# EAGLE design board-v4 (EAGLE 6.5.0)
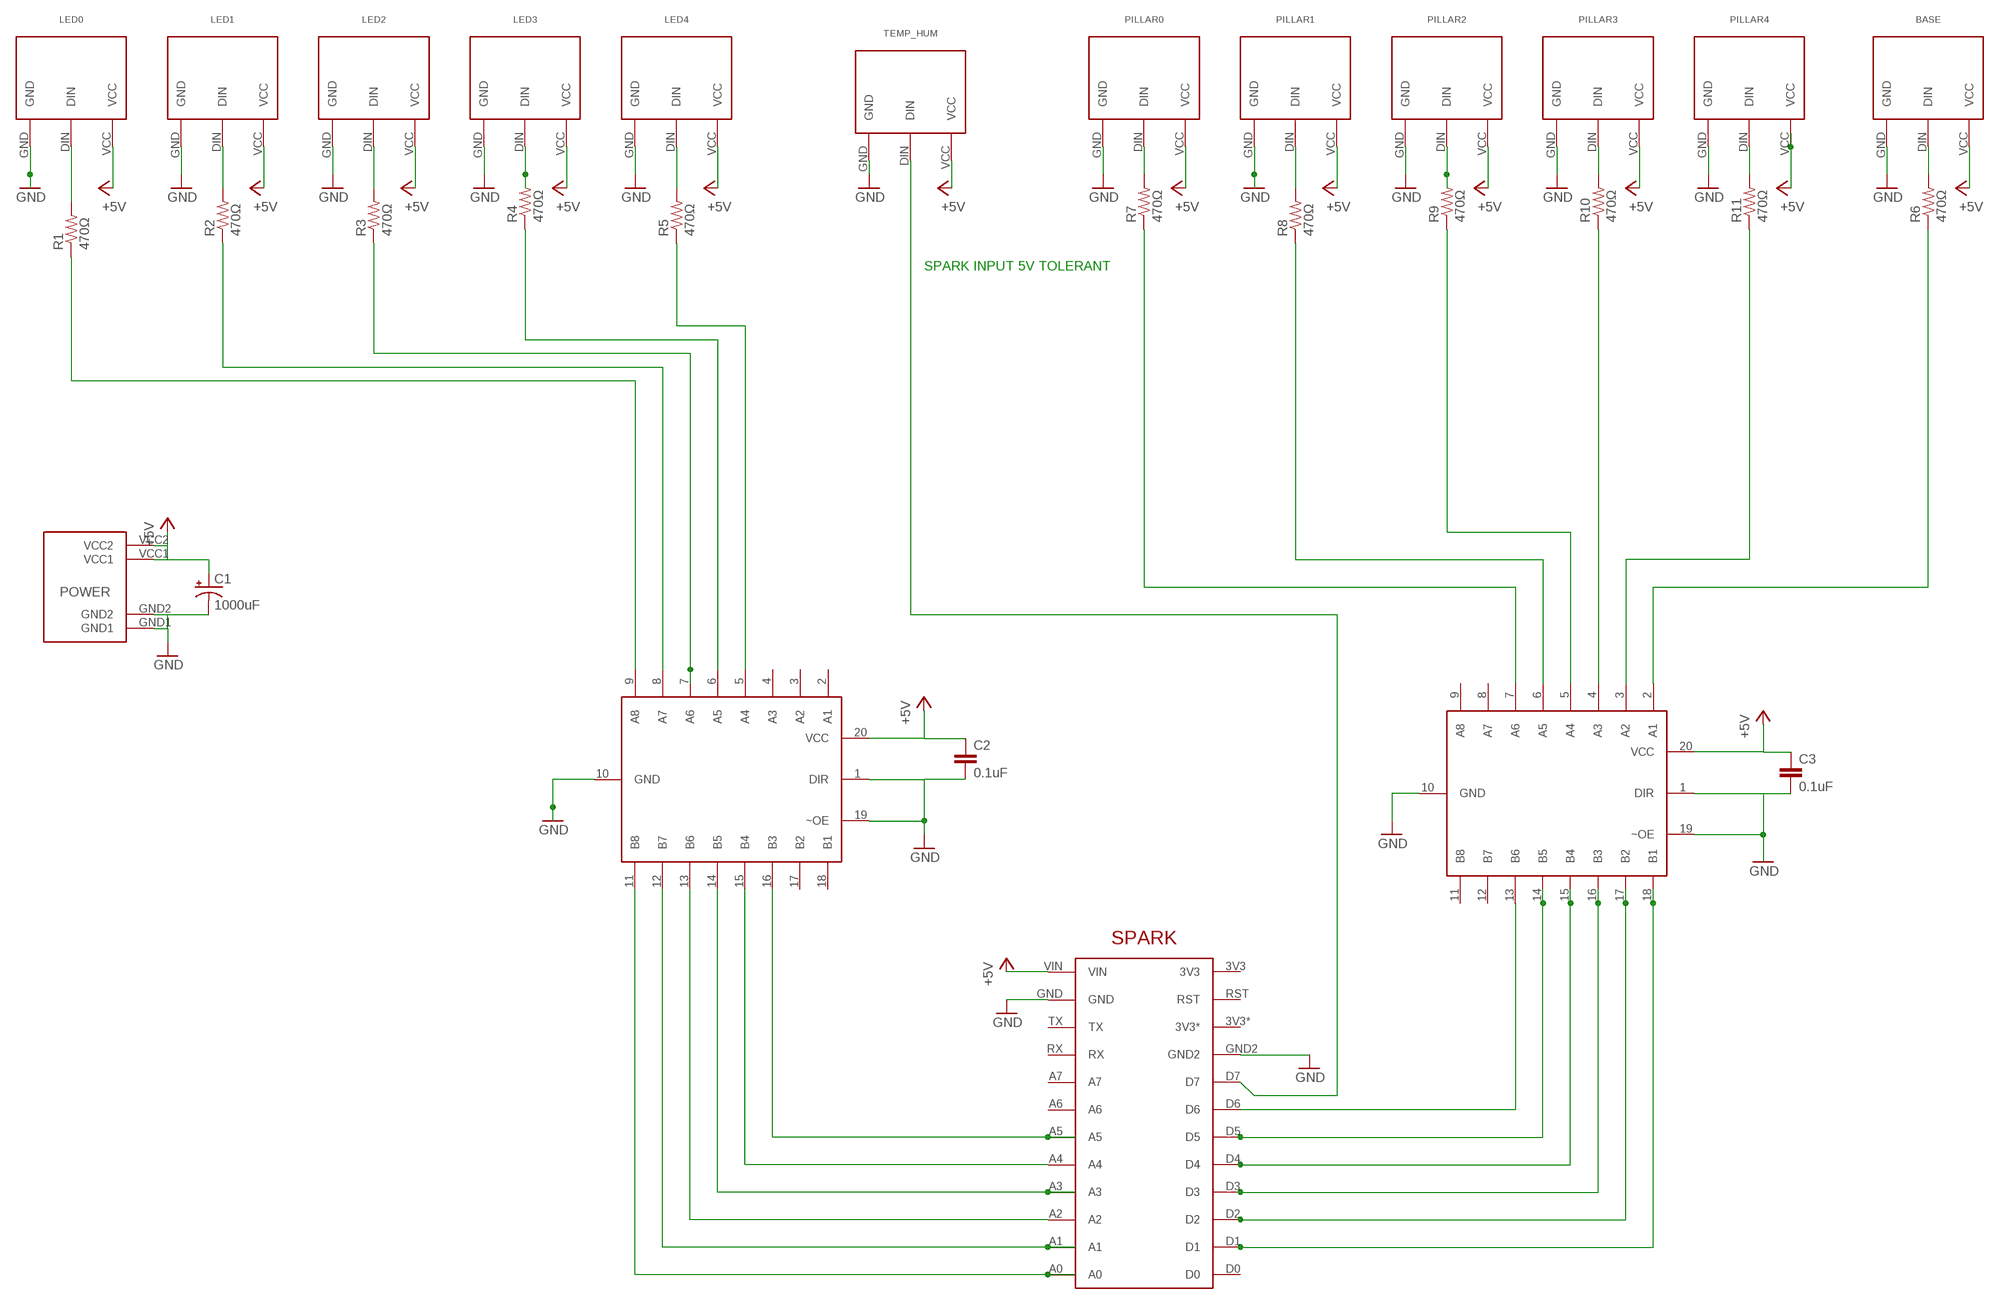
[diagram p0: schematic, sheet 1]

## Parts
BASE  MOLEX_3PIN_SMT_43650-310  [MOLEX_3PIN_SMT_43650-310]
C1  1000uF  CAP_POLPTH4  [CPOL-RADIAL-1000UF-25V]
C2  0.1uF  CAP0805  [0805]
C3  0.1uF  CAP0805  [0805]
LED0  MOLEX_3PIN_SMT_43650-310  [MOLEX_3PIN_SMT_43650-310]
LED1  MOLEX_3PIN_SMT_43650-310  [MOLEX_3PIN_SMT_43650-310]
LED2  MOLEX_3PIN_SMT_43650-310  [MOLEX_3PIN_SMT_43650-310]
LED3  MOLEX_3PIN_SMT_43650-310  [MOLEX_3PIN_SMT_43650-310]
LED4  MOLEX_3PIN_SMT_43650-310  [MOLEX_3PIN_SMT_43650-310]
PILLAR0  MOLEX_3PIN_SMT_43650-310  [MOLEX_3PIN_SMT_43650-310]
PILLAR1  MOLEX_3PIN_SMT_43650-310  [MOLEX_3PIN_SMT_43650-310]
PILLAR2  MOLEX_3PIN_SMT_43650-310  [MOLEX_3PIN_SMT_43650-310]
PILLAR3  MOLEX_3PIN_SMT_43650-310  [MOLEX_3PIN_SMT_43650-310]
PILLAR4  MOLEX_3PIN_SMT_43650-310  [MOLEX_3PIN_SMT_43650-310]
POWER  MOLEX_2PIN_SABRE_POWER  [MOLEX_2PIN_SABRE_POWER]
R1  470Ω  RESISTOR0805-RES  [0805]
R2  470Ω  RESISTOR0805-RES  [0805]
R3  470Ω  RESISTOR0805-RES  [0805]
R4  470Ω  RESISTOR0805-RES  [0805]
R5  470Ω  RESISTOR0805-RES  [0805]
R6  470Ω  RESISTOR0805-RES  [0805]
R7  470Ω  RESISTOR0805-RES  [0805]
R8  470Ω  RESISTOR0805-RES  [0805]
R9  470Ω  RESISTOR0805-RES  [0805]
R10  470Ω  RESISTOR0805-RES  [0805]
R11  470Ω  RESISTOR0805-RES  [0805]
SHIFT1  TI_74HCT245DWR  [SOIC-20]
SHIFT2  TI_74HCT245DWR  [SOIC-20]
SPARK  SPARKCORE  [SPARKCORE]
TEMP_HUM  MOLEX_3PIN_SMT_43650-310  [MOLEX_3PIN_SMT_43650-310]

## Nets
+5V [power]: BASE.VCC C1.1(+) C2.1 C3.1 LED0.VCC LED1.VCC LED2.VCC LED3.VCC LED4.VCC PILLAR0.VCC PILLAR1.VCC PILLAR2.VCC PILLAR3.VCC PILLAR4.VCC POWER.VCC1 POWER.VCC2 SHIFT1.20(VCC) SHIFT2.20(VCC) SPARK.VIN TEMP_HUM.VCC
GND [power]: BASE.GND C1.2(-) C2.2 C3.2 LED0.GND LED1.GND LED2.GND LED3.GND LED4.GND PILLAR0.GND PILLAR1.GND PILLAR2.GND PILLAR3.GND PILLAR4.GND POWER.GND1 POWER.GND2 SHIFT1.1(DIR) SHIFT1.10(GND) SHIFT1.19(~OE) SHIFT2.1(DIR) SHIFT2.10(GND) SHIFT2.19(~OE) SPARK.GND SPARK.GND2 TEMP_HUM.GND
N$1: SPARK.D7 TEMP_HUM.DIN
N$2: SHIFT2.17(B2) SPARK.D2
N$3: PILLAR0.DIN R7.2
N$4: LED0.DIN R1.2
N$5: R1.1 SHIFT1.9(A8)
N$6: LED1.DIN R2.2
N$7: LED2.DIN R3.2
N$8: LED3.DIN R4.2
N$9: LED4.DIN R5.2
N$10: R6.1 SHIFT2.2(A1)
N$11: BASE.DIN R6.2
N$13: R11.1 SHIFT2.3(A2)
N$14: PILLAR1.DIN R8.2
N$15: R10.1 SHIFT2.4(A3)
N$16: PILLAR2.DIN R9.2
N$17: PILLAR3.DIN R10.2
N$18: PILLAR4.DIN R11.2
N$19: R2.1 SHIFT1.8(A7)
N$20: R3.1 SHIFT1.7(A6)
N$21: R4.1 SHIFT1.6(A5)
N$22: R5.1 SHIFT1.5(A4)
N$23: R9.1 SHIFT2.5(A4)
N$24: R8.1 SHIFT2.6(A5)
N$25: R7.1 SHIFT2.7(A6)
N$26: SHIFT2.13(B6) SPARK.D6
N$30: SHIFT2.18(B1) SPARK.D1
N$31: SHIFT2.16(B3) SPARK.D3
N$32: SHIFT2.14(B5) SPARK.D5
N$33: SHIFT2.15(B4) SPARK.D4
N$34: SHIFT1.11(B8) SPARK.A0
N$35: SHIFT1.12(B7) SPARK.A1
N$36: SHIFT1.13(B6) SPARK.A2
N$37: SHIFT1.14(B5) SPARK.A3
N$38: SHIFT1.15(B4) SPARK.A4
N$39: SHIFT1.16(B3) SPARK.A5
Unconnected: SHIFT1.2(A1) SHIFT1.3(A2) SHIFT1.4(A3) SHIFT1.17(B2) SHIFT1.18(B1) SHIFT2.8(A7) SHIFT2.9(A8) SHIFT2.11(B8) SHIFT2.12(B7) SPARK.3V3 SPARK.3V3* SPARK.A6 SPARK.A7 SPARK.D0 SPARK.RST SPARK.RX SPARK.TX

## Notes on the sheet
- SPARK INPUT 5V TOLERANT

## Library data of the parts
BASE LED0 LED1-LED4 PILLAR0 PILLAR1-PILLAR4 TEMP_HUM = tjw:MOLEX_3PIN_SMT_43650-310
C1 = SparkFun-Passives:CAP_POL: Capacitor Polarized These are standard SMD and PTH capacitors. Normally 10uF, 47uF, and 100uF in electrolytic and tantalum varieties. Always verify the external diameter of the through hole cap, it varies with capacity, voltage, and manufacturer. The EIA devices should be standard.
C2 C3 = SparkFun-Capacitors:CAP: Capacitor Standard 0603 ceramic capacitor, and 0.1" leaded capacitor.
POWER = tjw:MOLEX_2PIN_SABRE_POWER
R1-R11 = SparkFun-Passives:RESISTOR: Resistor Basic schematic elements and footprints for 0603, 1206, and PTH resistors.
SHIFT1 SHIFT2 = tjw:TI_74HCT245DWR
SPARK = tjw:SPARKCORE: Spark Core

## Net classes
1 power: width 3.556 mm

## Board
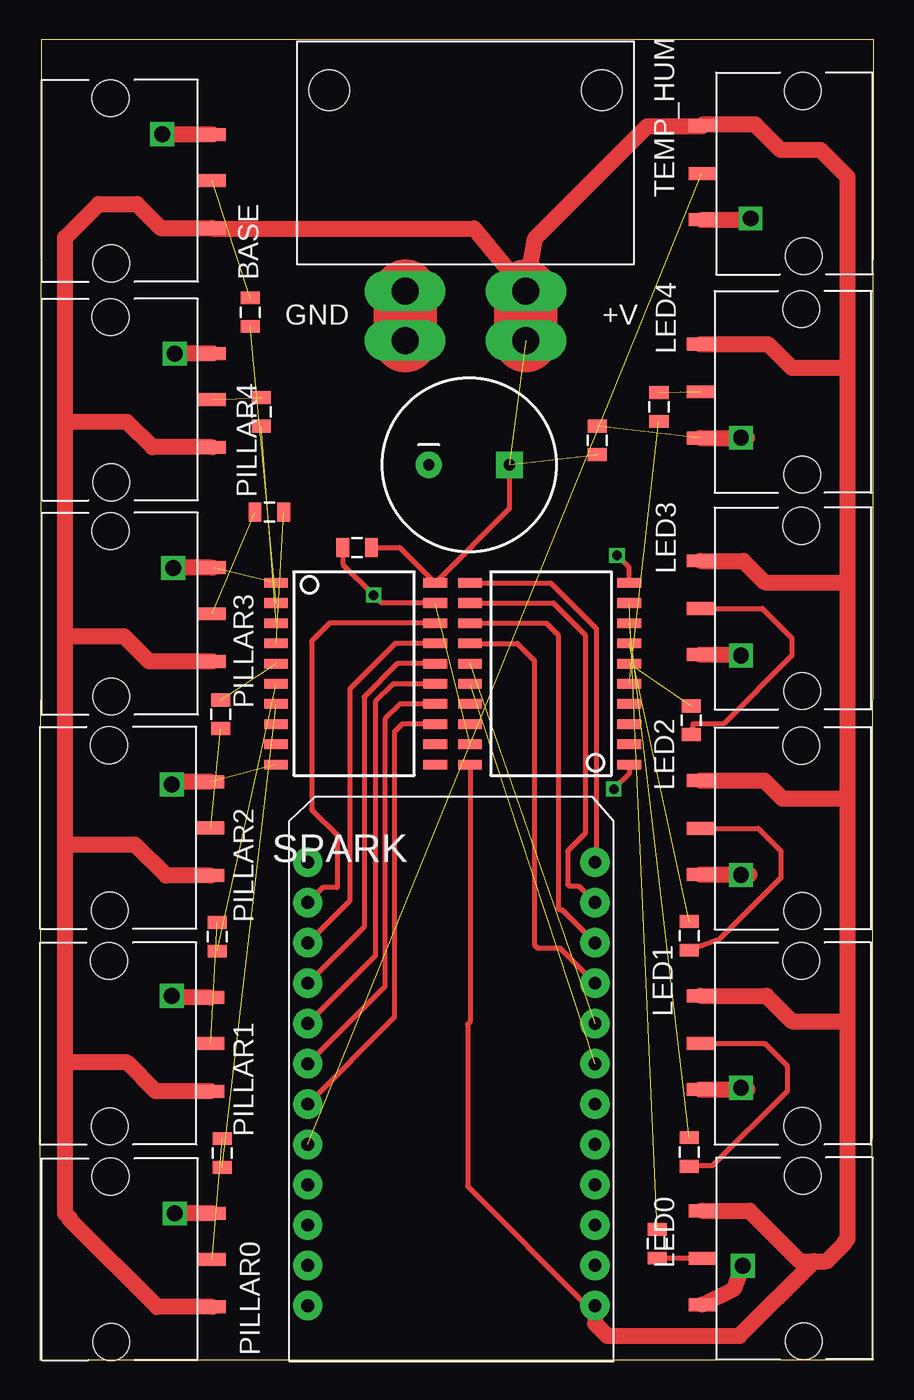
[diagram p1: board, top side]
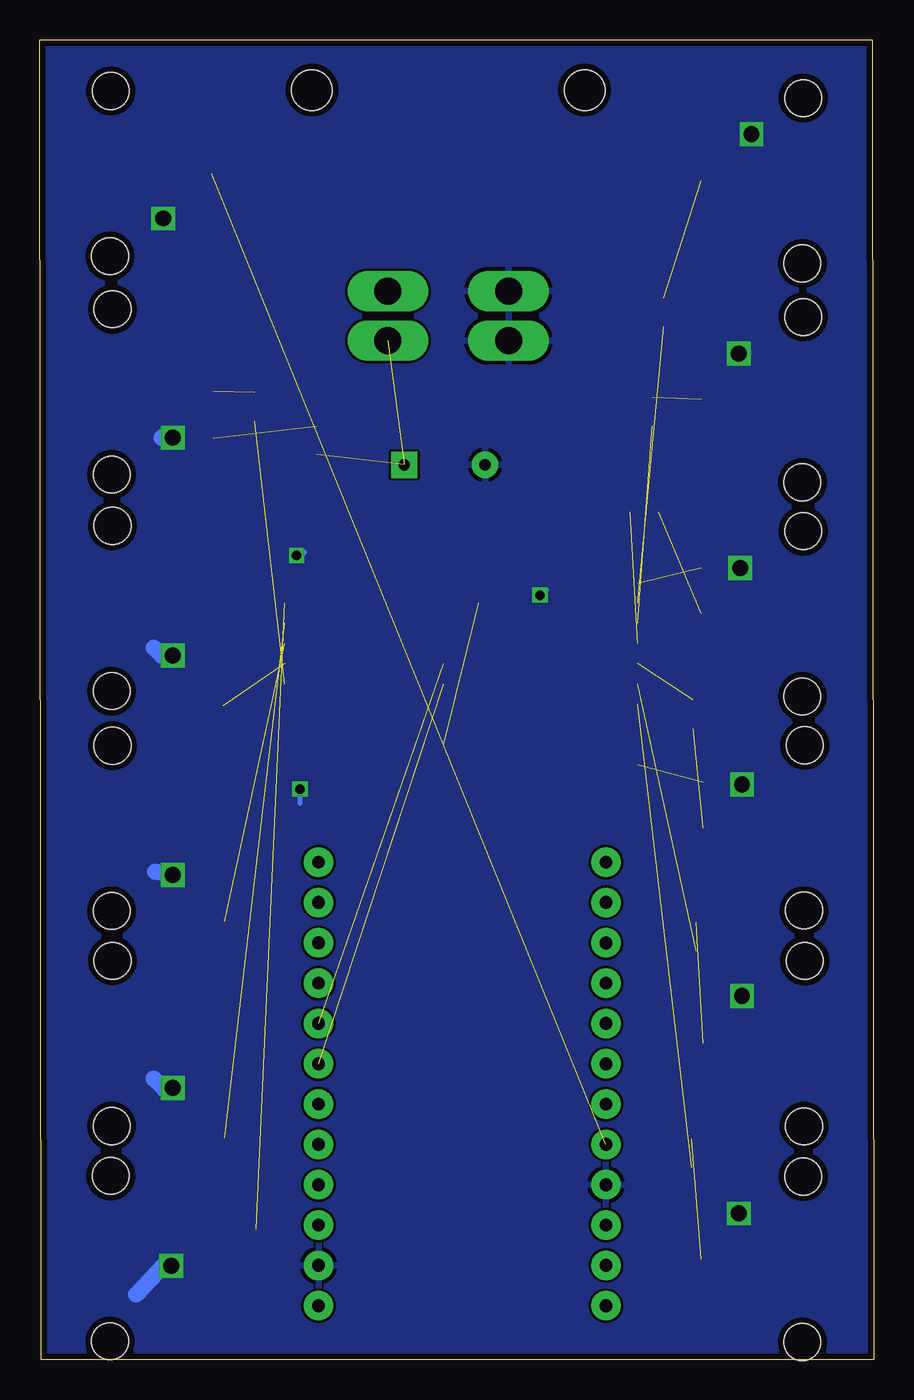
[diagram p2: board, bottom side, seen from below]

Size 52.46 x 83.04 mm. Coordinates in mm from the lower left corner, seen from the top.
Outline: 0,0 52.36,0 52.46,83.04 0.1,83.04 0,0
Copper layers (1*16): Top 0.0356mm / dielectric 1.5011mm / Bottom 0.0356mm
Design rules "OSH Park": minimum track width 6mil, minimum drill 13mil, track to track 6mil, track to pad 6mil, pad to pad 6mil, via to via 6mil, smd to smd 6mil, copper to edge 15mil, drill to drill 6mil, minimum pad ring 7mil, minimum via ring 7mil, stop-mask expansion 3mil, vias tented up to drill 0mil, thermal gap 10mil

### Footprints (pad centres in the part's own frame; a part is rotated, then mirrored left to right if it is on the bottom)
MOLEX_3PIN_SMT_43650-310 = smd 0.813 x 1.676: DIN 6.35,-0.9; GND 9.25,-0.9; VCC 3.35,-0.9 | hole 2.3: 1.15,5.45; 11.55,5.5
CPOL-RADIAL-1000UF-25V = drill 0.7 pad 1.651 square: 1 2.54,0 | drill 0.7 pad 1.651: 2 -2.54,0
0805 = smd 0.8 x 1.2: 1 -0.9,0; 2 0.9,0
MOLEX_2PIN_SABRE_POWER = drill 1.7 pad 2.2 long: GND1 6.8,-1.7; GND2 6.8,-4.8; VCC1 14.4,-1.7; VCC2 14.4,-4.8 | hole 2.55: 2.025,10.95; 19.175,10.95
SOIC-20 = smd 0.6 x 1.5: 1 -5.715,-5; 2 -4.445,-5; 3 -3.175,-5; 4 -1.905,-5; 5 -0.635,-5; 6 0.635,-5; 7 1.905,-5; 8 3.175,-5; 9 4.445,-5; 10 5.715,-5; 11 5.715,5; 12 4.445,5; 13 3.175,5; 14 1.905,5; 15 0.635,5; 16 -0.635,5; 17 -1.905,5; 18 -3.175,5; 19 -4.445,5; 20 -5.715,5
SPARKCORE = drill 0.8 pad 1.85: 3V3 1.165,3.5; 3V3* 1.165,8.573; A0 19.235,31.399; A1 19.235,28.863; A2 19.235,26.327; A3 19.235,23.79; A4 19.235,21.254; A5 19.235,18.718; A6 19.235,16.182; A7 19.235,13.645; D0 1.165,31.399; D1 1.165,28.863; D2 1.165,26.327; D3 1.165,23.79; D4 1.165,21.254; D5 1.165,18.718; D6 1.165,16.181; D7 1.165,13.645; GND 19.235,6.036; GND2 1.165,11.109; RST 1.165,6.036; RX 19.235,11.109; TX 19.235,8.572; VIN 19.235,3.5

### Placement (x,y rotation side)
BASE  9.95,67.82 90 top
C1  27,56.3 0 top
C2  19.96,51.1 180 top
C3  35.05,57.84 90 top
LED0  42.54,12.72 270 top
LED1  42.44,26.25 270 top
LED2  42.44,39.78 270 top
LED3  42.44,53.61 270 top
LED4  42.44,67.24 270 top
PILLAR0  9.95,-0.03 90 top
PILLAR1  9.85,13.54 90 top
PILLAR2  9.85,27.11 90 top
PILLAR3  9.95,40.58 90 top
PILLAR4  9.95,54.05 90 top
POWER  16.17,68.92 0 top
R1  38.84,7.3 270 top
R2  40.84,13.07 270 top
R3  40.84,26.67 270 top
R4  40.96,40.23 270 top
R5  38.94,59.94 90 top
R6  13.23,65.9 90 top
R7  11.47,13.01 90 top
R8  11.17,26.61 90 top
R9  11.37,40.61 270 top
R10  14.44,53.33 180 top
R11  13.93,59.63 90 top
SHIFT1  32.06,43.16 90 top
SHIFT2  19.86,43.16 270 top
SPARK  15.69,-0.1 0 top
TEMP_HUM  42.54,80.97 270 top

### Tracks (layer width: path | path; a pad name or v marks a point on that pad's centre or on a via)
+5V  (2 unrouted)
  Top 0.305: C1.1 29.54,53.55 SHIFT2.20 22.64,51.1 C2.1 | SHIFT1.20 27.06,21.26 26.9,21.1 26.9,10.9 34.4,3.4 SPARK.VIN
  Top 0.406: 41.62,77.6 TEMP_HUM.VCC
  Top 1: POWER.VCC1 31.17,70.57 38.2,77.6 41.62,77.6 | SPARK.VIN 34.92,2.27 35.7,1.5 44,1.5 48.7,6.2
  Top 1.016: POWER.VCC1 27.32,71.17 BASE.VCC 10.82,71.2 7.6,71.2 6.1,72.7 3.7,72.7 1.6,70.6 1.6,59 | PILLAR0.VCC 7.38,3.32 1.9,8.8 1.9,8.9 1.6,9.2 1.6,18.9 | 1.6,18.9 1.6,32.4 | 1.6,32.4 1.6,45.4 | 1.6,45.4 1.6,59 | PILLAR1.VCC 7.31,16.89 5.5,18.7 1.8,18.7 1.6,18.9 | PILLAR2.VCC 7.94,30.46 6,32.4 1.6,32.4 | PILLAR3.VCC 6.87,43.93 5.3,45.5 1.7,45.5 1.6,45.4 | PILLAR4.VCC 7.1,57.4 5.5,59 1.6,59 | LED0.VCC 44.63,9.37 47.8,6.2 48.7,6.2 49.5,6.2 50.6,7.3 50.6,7.4 50.8,7.6 50.8,21.3 | 50.8,21.3 50.8,35.3 | 50.8,35.3 50.8,48.8 | 50.8,48.8 50.8,62.4 | 50.8,62.4 50.8,74.4 49.1,76.1 46.6,76.1 45,77.7 41.72,77.7 TEMP_HUM.VCC | LED4.VCC 45.81,63.89 47.3,62.4 50.8,62.4 | LED3.VCC 44.24,50.26 45.6,48.9 50.7,48.9 50.8,48.8 | LED2.VCC 45.57,36.43 46.7,35.3 50.8,35.3 | LED1.VCC 45.7,22.9 47.3,21.3 50.8,21.3
  Top 4: POWER.VCC1 POWER.VCC2
GND  (via drill 0.6, 1)  (4 unrouted)
  Top 0.305: SHIFT1.1 37.06,36.86 v36.1,35.9 | SHIFT1.10 37.06,49.84 v36.3,50.6 | SHIFT2.19 21.5,47.6 v21,48.1 19.06,50.04 C2.2
  Top 1.016: LED0.GND 43.67,4.47 v44.2,5.9 | LED1.GND 44.5,17 v44.1,17.1 | LED2.GND 44.63,30.53 v44.1,30.5 | LED3.GND 44.14,44.36 v44.1,44.3 | LED4.GND 44.49,57.99 v44.1,58 | TEMP_HUM.GND 44.62,71.72 v44.7,71.8 | BASE.GND 7.93,77.07 7.9,77.1 7.9,77 7.8,77 v7.7,77.1 | PILLAR4.GND v8.5,63.3 | PILLAR3.GND 8.4,49.83 v8.4,49.8 | PILLAR2.GND 8.3,36.36 v8.3,36.2 | PILLAR1.GND 8.3,22.79 v8.3,22.9 | PILLAR0.GND 8.5,9.22 v8.5,9.2
  Top 4: POWER.GND1 POWER.GND2
  Bottom 0.305: v36.1,35.9 36.1,35 | v36.3,50.6 36,50.6 35.8,50.8 | v21,48.1 20.9,48.1 20.6,48.4
  Bottom 1.016: v44.2,5.9 44.7,5.9 46.4,4.1 | v44.1,17.1 44.6,17 45.3,17.7 | v44.1,30.5 45.2,30.7 | v44.1,44.3 44.8,44.3 45.3,44.8 | v44.1,58 44.7,58.1 44.8,58 | v44.7,71.8 44.8,71.8 | v7.7,77.1 7.8,77.1 7.9,77 | v8.5,63.3 8.2,63.3 | v8.4,49.8 8.2,49.8 8.2,49.7 | v8.3,36.2 8.2,36.2 8.2,36.3 | v8.3,22.9 8.2,22.9 8.2,22.8 | v8.5,9.2 8.3,9.2 8.3,9.1
  pour Bottom: -1.27,81.28 -1.27,-1.27 102.87,-1.27 102.87,82.55 0,82.55 -1.27,82.55
N$1  (1 unrouted)
N$2
  Top 0.305: SHIFT2.17 22.36,45.06 19.5,42.2 19.5,28.87 SPARK.D2
N$3  (1 unrouted)
N$4
  Top 0.305: R1.2 41.61,6.4 LED0.DIN
N$5  (1 unrouted)
N$6
  Top 0.305: LED1.DIN 45.6,19.9 47,18.5 47,16.9 42.3,12.2 40.87,12.2 R2.2
N$7
  Top 0.305: LED2.DIN 45.17,33.43 46.6,32 46.6,30.3 42.77,26.47 R3.2
N$8
  Top 0.305: LED3.DIN 45.44,47.26 47.3,45.4 47.3,44.3 43,40 41.09,40 R4.2
N$9  (1 unrouted)
N$10  (1 unrouted)
N$11  (1 unrouted)
N$13  (1 unrouted)
N$14  (1 unrouted)
N$15  (1 unrouted)
N$16  (1 unrouted)
N$17  (1 unrouted)
N$18  (1 unrouted)
N$19  (1 unrouted)
N$20  (1 unrouted)
N$21  (1 unrouted)
N$22  (1 unrouted)
N$23  (1 unrouted)
N$24  (1 unrouted)
N$25  (1 unrouted)
N$26
  Top 0.305: SHIFT2.13 22.79,39.98 22.3,39.5 22.3,21.53 SPARK.D6
N$30
  Top 0.305: SHIFT2.18 18.23,46.34 17.1,45.2 17.1,34.6 18.7,33 18.7,29.7 17.79,29.7 SPARK.D1
N$31
  Top 0.305: SHIFT2.16 22.5,43.8 20.4,41.7 20.4,27.23 SPARK.D3
N$32
  Top 0.305: SHIFT2.14 22.66,41.26 21.7,40.3 21.7,23.46 SPARK.D5
N$33
  Top 0.305: SHIFT2.15 22.23,42.52 21.1,41.4 21.1,25.4 SPARK.D4
N$34
  Top 0.305: SHIFT1.11 32.12,48.88 35,46 35,31.37 SPARK.A0
N$35
  Top 0.305: SHIFT1.12 32.3,47.6 34.3,45.6 34.3,33.1 33.2,32 33.2,29.9 33.3,29.8 33.89,29.8 SPARK.A1
N$36
  Top 0.305: SHIFT1.13 31.86,46.34 32.6,45.6 32.6,28.4 32.7,28.3 32.85,28.3 SPARK.A2
N$37
  Top 0.305: SHIFT1.14 30.04,45.06 31.1,44 31.1,26.1 31.3,25.9 32.72,25.9 SPARK.A3
N$38  (1 unrouted)
N$39  (1 unrouted)

### Text on the board
tNames: SPARK